# EAGLE design M149A (EAGLE 6.6.0)
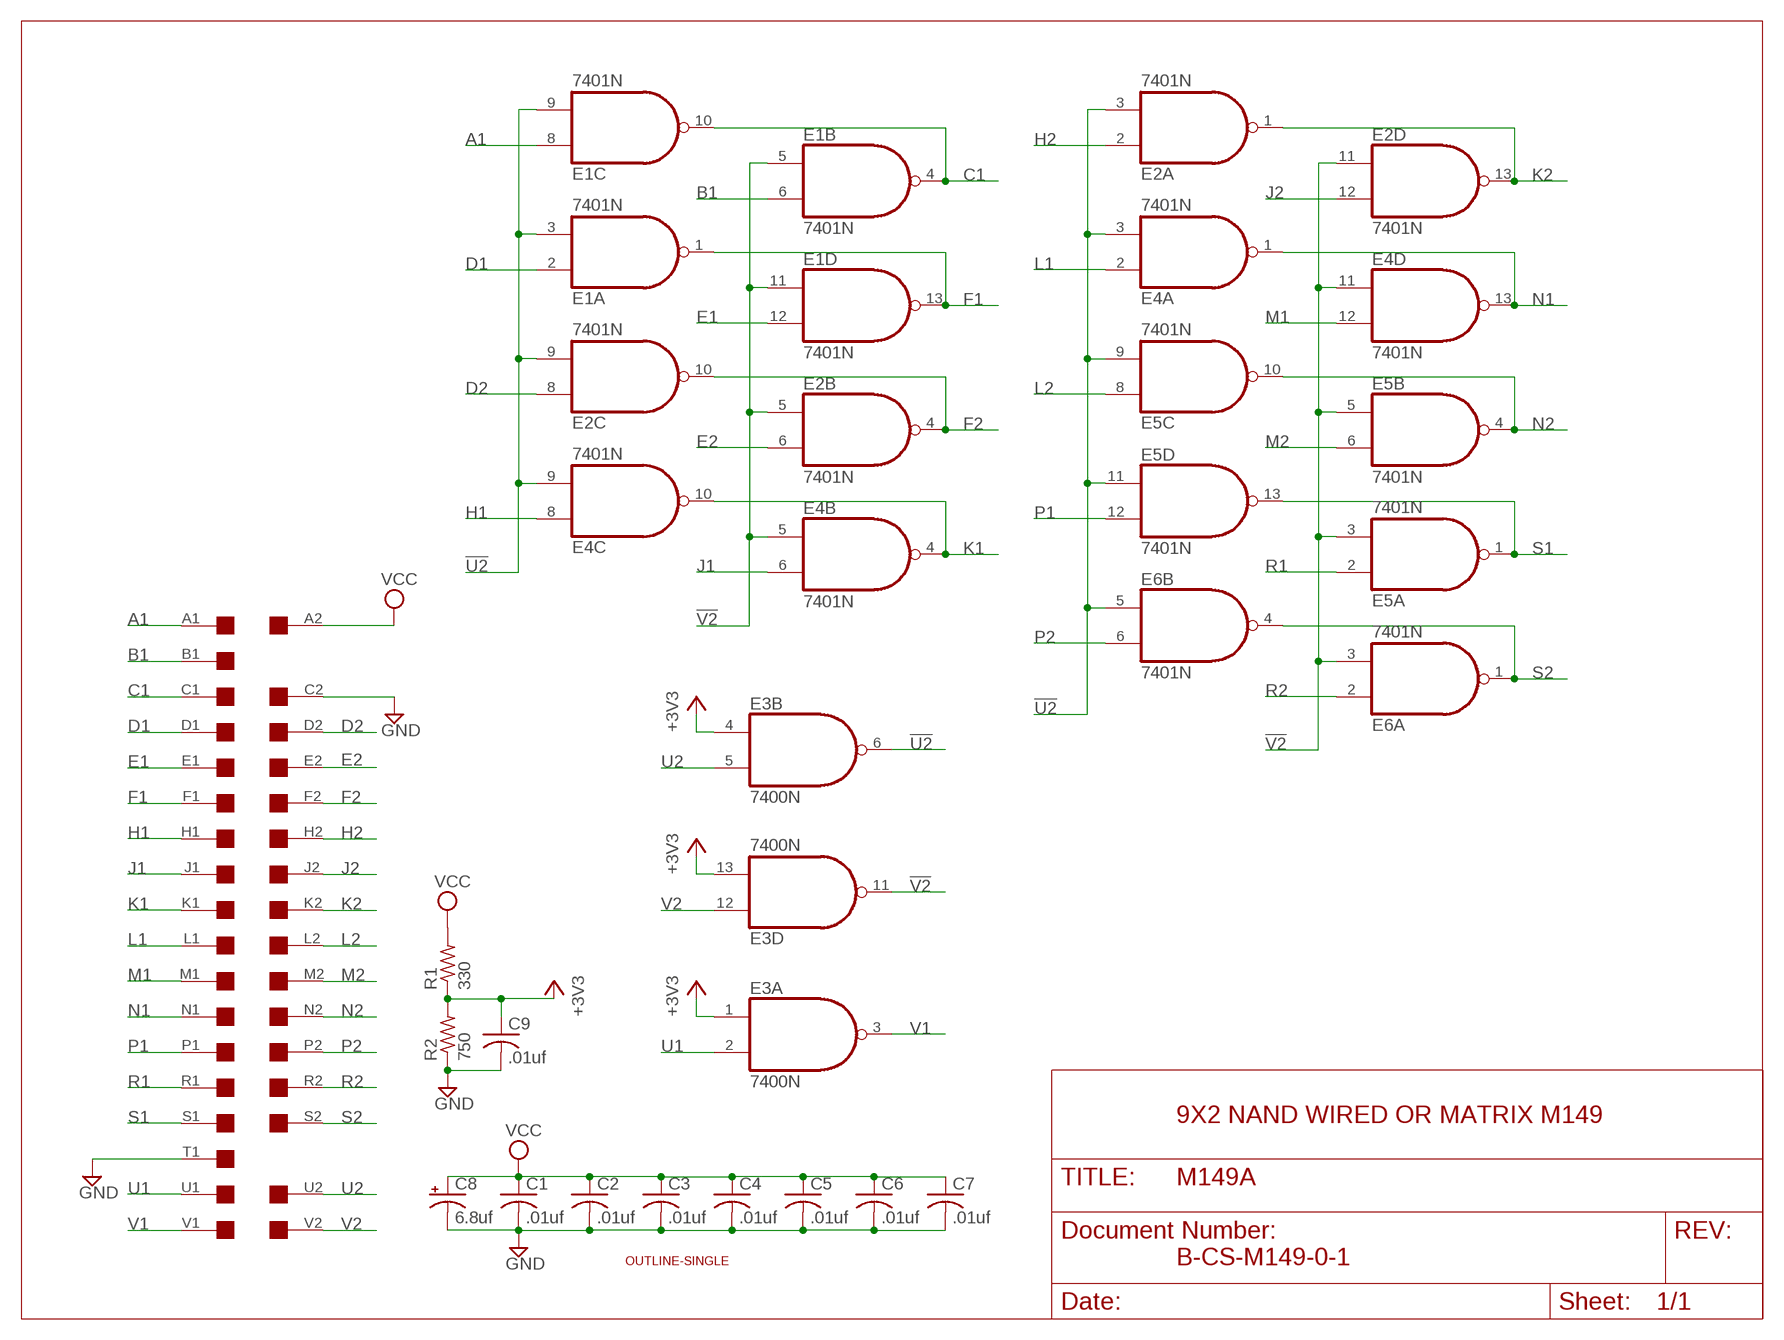
[diagram p0: schematic, sheet 1]

## Parts
C1  .01uf  C-US050-025X075  [C050-025X075]
C2  .01uf  C-US050-025X075  [C050-025X075]
C3  .01uf  C-US050-025X075  [C050-025X075]
C4  .01uf  C-US050-025X075  [C050-025X075]
C5  .01uf  C-US050-025X075  [C050-025X075]
C6  .01uf  C-US050-025X075  [C050-025X075]
C7  .01uf  C-US050-025X075  [C050-025X075]
C8  6.8uf  CPOL-USE15-5AXIAL  [E15-5]
C9  .01uf  C-US050-025X075  [C050-025X075]
E1  7401N  74LS01N  [DIL14]
E2  7401N  74LS01N  [DIL14]
E3  7400N  [DIL14]
E4  7401N  74LS01N  [DIL14]
E5  7401N  74LS01N  [DIL14]
E6  7401N  74LS01N  [DIL14]
R1  330  R-US_0207/10  [0207/10]
R2  750  R-US_0207/10  [0207/10]
U$1  SINGLE  [EDGE-CON2]
U$4  OUTLINE-SINGLE  [SINGLE]

## Nets
!U2: E1.3(A:I1) E1.9(C:I1) E2.3(A:I1) E2.9(C:I1) E3.6(B:O) E4.3(A:I1) E4.9(C:I1) E5.9(C:I1) E5.11(D:I0) E6.5(B:I0)
!V2: E1.5(B:I0) E1.11(D:I0) E2.5(B:I0) E2.11(D:I0) E3.11(D:O) E4.5(B:I0) E4.11(D:I0) E5.3(A:I1) E5.5(B:I0) E6.3(A:I1)
+3V3: C9.1 E3.1(A:I0) E3.4(B:I0) E3.13(D:I1) R1.1 R2.2
A1: E1.8(C:I0) U$1.A1
B1: E1.6(B:I1) U$1.B1
C1: E1.4(B:O) E1.10(C:O) U$1.C1
D1: E1.2(A:I0) U$1.D1
D2: E2.8(C:I0) U$1.D2
E1: E1.12(D:I1) U$1.E1
E2: E2.6(B:I1) U$1.E2
F1: E1.1(A:O) E1.13(D:O) U$1.F1
F2: E2.4(B:O) E2.10(C:O) U$1.F2
GND [Supply]: C1.2 C2.2 C3.2 C4.2 C5.2 C6.2 C7.2 C8.- C9.2 R2.1 U$1.C2 U$1.T1
H1: E4.8(C:I0) U$1.H1
H2: E2.2(A:I0) U$1.H2
J1: E4.6(B:I1) U$1.J1
J2: E2.12(D:I1) U$1.J2
K1: E4.4(B:O) E4.10(C:O) U$1.K1
K2: E2.1(A:O) E2.13(D:O) U$1.K2
L1: E4.2(A:I0) U$1.L1
L2: E5.8(C:I0) U$1.L2
M1: E4.12(D:I1) U$1.M1
M2: E5.6(B:I1) U$1.M2
N1: E4.1(A:O) E4.13(D:O) U$1.N1
N2: E5.4(B:O) E5.10(C:O) U$1.N2
P1: E5.12(D:I1) U$1.P1
P2: E6.6(B:I1) U$1.P2
R1: E5.2(A:I0) U$1.R1
R2: E6.2(A:I0) U$1.R2
S1: E5.1(A:O) E5.13(D:O) U$1.S1
S2: E6.1(A:O) E6.4(B:O) U$1.S2
U1: E3.2(A:I1) U$1.U1
U2: E3.5(B:I1) U$1.U2
V1: E3.3(A:O) U$1.V1
V2: E3.12(D:I0) U$1.V2
VCC [Supply]: C1.1 C2.1 C3.1 C4.1 C5.1 C6.1 C7.1 C8.+ R1.2 U$1.A2
Unconnected: E3.8(C:O) E3.9(C:I0) E3.10(C:I1) E6.8(C:I0) E6.9(C:I1) E6.10(C:O) E6.11(D:I0) E6.12(D:I1) E6.13(D:O) U$1.B2 U$1.T2

## Notes on the sheet
- 9X2 NAND WIRED OR MATRIX M149
- B-CS-M149-0-1

## Power pins joined to a net without a drawn wire
GND: E1.7(P:GND) E2.7(P:GND) E3.7(P:GND) E4.7(P:GND) E5.7(P:GND) E6.7(P:GND)
VCC: E1.14(P:VCC) E2.14(P:VCC) E3.14(P:VCC) E4.14(P:VCC) E5.14(P:VCC) E6.14(P:VCC)

## Library data of the parts
C1-C7 C9 = rcl:C-US: CAPACITOR, American symbol
C8 = rcl:CPOL-US: POLARIZED CAPACITOR, American symbol
E1 E2 E4-E6 = 74xx-us:74*01: Quad 2-input NAND gate, open collector
E3 = 74xx-us:74*00: Quad 2-input NAND gate
R1 R2 = rcl:R-US_: RESISTOR, American symbol
U$1 = dec-con:SINGLE: Single-Height DEC board
U$4 = dec-con:OUTLINE-*: Board outlines for DEC boards.

## Net classes
1 Supply: width 0.813 mm

## Board
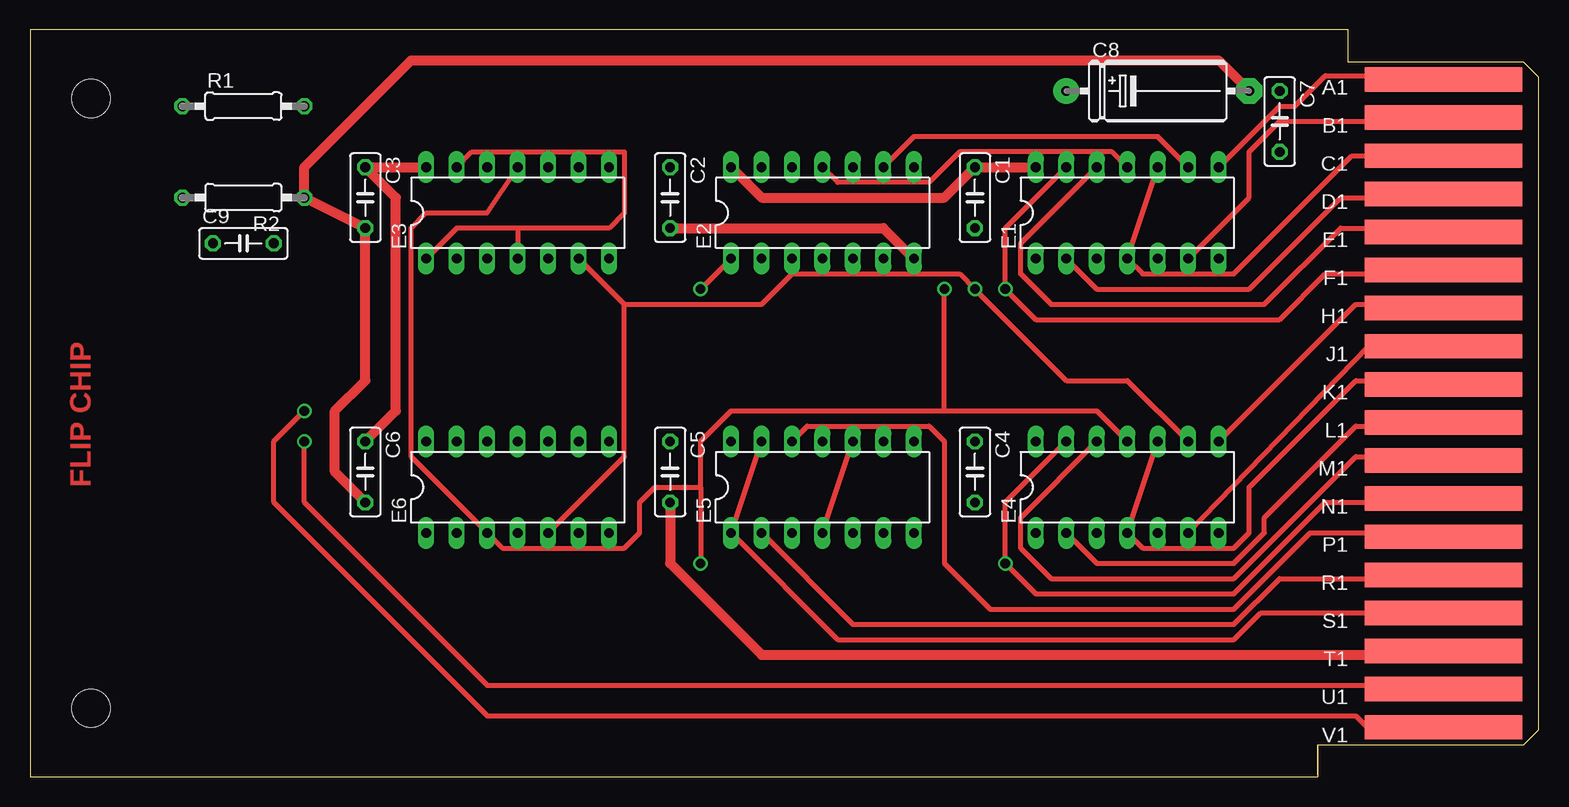
[diagram p1: board, top side]
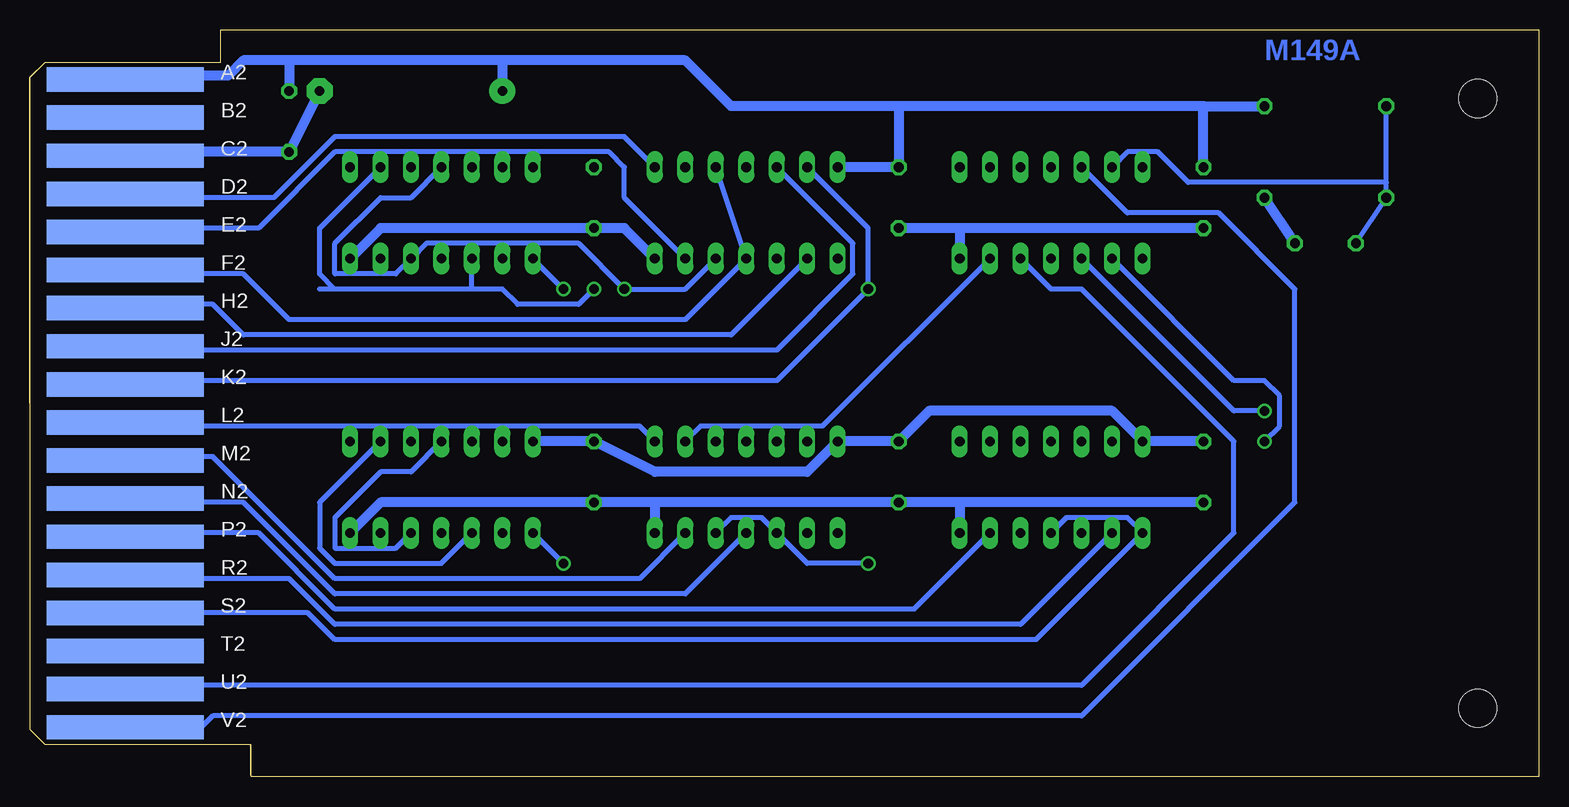
[diagram p2: board, bottom side, seen from below]

Size 125.73 x 62.23 mm. Coordinates in mm from the lower left corner, seen from the top.
Copper layers (1+16): Top 0.035mm / dielectric 1.5mm / Bottom 0.035mm
Design rules "16mils": minimum track width 16mil, minimum drill 32mil, track to track 15mil, track to pad 10mil, pad to pad 10mil, via to via 10mil, smd to smd 10mil, copper to edge 13mil, drill to drill 10mil, minimum pad ring 10mil, minimum via ring 8mil, stop-mask expansion 0mil, vias tented up to drill 0mil, thermal gap 10mil

### Footprints (pad centres in the part's own frame; a part is rotated, then mirrored left to right if it is on the bottom)
C050-025X075 = drill 0.813 octagon: 1 -2.54,0; 2 2.54,0
E15-5 = drill 0.813 pad 2.159: + -7.62,0 | drill 0.813 pad 2.159 octagon: - 7.62,0
DIL14 = drill 0.813 long: 1 -7.62,-3.81; 2 -5.08,-3.81; 3 -2.54,-3.81; 4 0,-3.81; 5 2.54,-3.81; 6 5.08,-3.81; 7 7.62,-3.81; 8 7.62,3.81; 9 5.08,3.81; 10 2.54,3.81; 11 0,3.81; 12 -2.54,3.81; 13 -5.08,3.81; 14 -7.62,3.81
0207/10 = drill 0.813 octagon: 1 -5.08,0; 2 5.08,0
EDGE-CON2 = smd 13.106 x 2.032: A1 7.938,4.128; B1 7.938,7.303; C1 7.938,10.477; D1 7.938,13.652; E1 7.938,16.828; F1 7.938,20.003; H1 7.938,23.177; J1 7.938,26.352; K1 7.938,29.527; L1 7.938,32.703; M1 7.938,35.877; N1 7.938,39.053; P1 7.938,42.227; R1 7.938,45.403; S1 7.938,48.578; T1 7.938,51.752; U1 7.938,54.928; V1 7.938,58.102 | smd 13.106 x 2.032 bottom: A2 7.938,4.128; B2 7.938,7.303; C2 7.938,10.477; D2 7.938,13.652; E2 7.938,16.828; F2 7.938,20.003; H2 7.938,23.177; J2 7.938,26.352; K2 7.938,29.527; L2 7.938,32.703; M2 7.938,35.877; N2 7.938,39.053; P2 7.938,42.227; R2 7.938,45.403; S2 7.938,48.578; T2 7.938,51.752; U2 7.938,54.928; V2 7.938,58.102
SINGLE = hole 3.175: 120.65,56.515; 120.65,5.715

### Placement (x,y rotation side)
C1  78.74,48.26 270 top
C2  53.34,48.26 270 top
C3  27.94,48.26 270 top
C4  78.74,25.4 270 top
C5  53.34,25.4 270 top
C6  27.94,25.4 270 top
C7  104.14,54.61 270 top
C8  93.98,57.15 0 top
C9  17.78,44.45 0 top
E1  91.44,46.99 0 top
E2  66.04,46.99 0 top
E3  40.64,46.99 0 top
E4  91.44,24.13 0 top
E5  66.04,24.13 0 top
E6  40.64,24.13 0 top
R1  17.78,55.88 0 top
R2  17.78,48.26 180 top
U$1  125.73,62.23 180 top
U$4  125.73,62.23 180 top

### Tracks (layer width: path | path; a pad name or v marks a point on that pad's centre or on a via)
!U2  (via drill 0.81)
  Top 0.406: E1.9 93.98,53.34 73.66,53.34 E2.9 | 49.53,39.37 E3.6 | 49.53,39.37 49.53,26.67 E6.5 | 63.5,41.91 77.47,41.91 v78.74,40.64 86.36,33.02 91.44,33.02 E4.9 | 49.53,39.37 60.96,39.37 63.5,41.91 | 63.5,41.91 E2.3
  Bottom 0.406: E4.3 91.44,17.78 100.33,17.78 101.6,19.05 101.6,22.86 E4.9 | v78.74,40.64 80.01,39.37 85.09,39.37 86.36,40.64 88.9,40.64 | 88.9,40.64 100.33,40.64 | 100.33,40.64 101.6,40.64 | 88.9,40.64 E1.3 | E1.9 101.6,45.72 101.6,41.91 100.33,40.64 | E5.9 69.85,29.21 66.04,29.21 | 66.04,29.21 E5.11 | 66.04,29.21 59.69,29.21 E3.6
!V2  (via drill 0.81)
  Top 0.406: 55.88,24.13 52.07,24.13 50.8,22.86 50.8,20.32 49.53,19.05 39.37,19.05 E6.3 31.75,26.67 31.75,45.72 33.02,46.99 38.1,46.99 E3.11 | 55.88,24.13 v55.88,17.78 | 55.88,24.13 55.88,27.94 58.42,30.48 76.2,30.48 | 76.2,30.48 v76.2,40.64 | 76.2,30.48 88.9,30.48 E4.11 | E2.11 67.31,49.53 74.93,49.53 77.47,52.07 90.17,52.07 E1.11
  Bottom 0.406: E2.5 71.12,40.64 v76.2,40.64 80.01,44.45 92.71,44.45 E1.5 95.25,41.91 100.33,41.91 100.33,44.45 96.52,48.26 93.98,48.26 E1.11 | E5.5 67.31,21.59 64.77,21.59 E5.3 60.96,17.78 v55.88,17.78 | E4.5 95.25,19.05 100.33,19.05 100.33,21.59 96.52,25.4 93.98,25.4 E4.11
+3V3
  Top 0.406: E3.13 36.83,52.07 49.53,52.07 49.53,46.99 48.26,45.72 40.64,45.72 | E3.1 35.56,45.72 40.64,45.72 | 40.64,45.72 E3.4
  Bottom 0.406: 12.7,49.53 R2.2 C9.1 | 12.7,49.53 R1.1 | 12.7,49.53 29.21,49.53 31.75,52.07 34.29,52.07 E3.13
A1
  Top 0.406: U$1.A1 112.16,58.02 111.76,58.42 107.95,58.42 105.41,55.88 104.14,55.88 E1.8
B1
  Top 0.406: U$1.B1 112.05,54.9 111.76,54.61 104.14,54.61 101.6,52.07 101.6,48.26 E1.6
C1
  Top 0.406: U$1.C1 110.16,51.74 100.33,41.91 92.71,41.91 E1.4 E1.10
D1
  Top 0.406: U$1.D1 111.76,48.26 109.22,48.26 101.6,40.64 88.9,40.64 E1.2
D2
  Bottom 0.406: U$1.D2 117.78,48.26 105.41,48.26 100.33,53.34 76.2,53.34 E2.8
E1
  Top 0.406: U$1.E1 112.09,45.39 111.76,45.72 109.22,45.72 102.87,39.37 85.09,39.37 82.55,41.91 82.55,44.45 E1.12
E2
  Bottom 0.406: E2.6 76.2,48.26 76.2,50.8 77.47,52.07 100.33,52.07 106.68,45.72 111.76,45.72 U$1.E2
F1  (via drill 0.81)
  Top 0.406: U$1.F1 112.04,42.19 111.76,41.91 107.95,41.91 104.14,38.1 83.82,38.1 v81.28,40.64 81.28,45.72 E1.13
  Bottom 0.406: v81.28,40.64 E1.1
F2
  Bottom 0.406: E2.10 E2.4 71.12,38.1 104.14,38.1 107.95,41.91 111.76,41.91 112.04,42.19 U$1.F2
GND
  Top 0.813: C8.- 99.06,59.69 31.75,59.69 22.86,50.8 R2.1 C3.2 27.94,33.02 25.4,30.48 25.4,25.4 C6.2 | U$1.T1 112.09,10.49 111.76,10.16 60.96,10.16 53.34,17.78 C5.2 | C2.2 71.12,45.72 E2.7
  Bottom 0.813: U$1.C2 112.09,51.74 111.76,52.07 C7.2 C8.- | R2.1 C9.2 | 48.26,45.72 E3.7 | C3.2 48.26,45.72 | E1.7 96.52,45.72 C1.2 76.2,45.72 E2.7 | 48.26,45.72 C2.2 | E4.7 96.52,22.86 C4.2 73.66,22.86 | 73.66,22.86 C5.2 48.26,22.86 | 73.66,22.86 E5.7 | C6.2 48.26,22.86 | 48.26,22.86 E6.7
H1
  Top 0.406: U$1.H1 112.09,39.04 111.76,39.37 110.49,39.37 E4.8
H2
  Bottom 0.406: U$1.H2 112.09,39.04 111.76,39.37 110.49,39.37 107.95,36.83 67.31,36.83 E2.2
J1
  Top 0.406: U$1.J1 111.58,35.89 E4.6
J2
  Bottom 0.406: E2.12 57.15,44.45 57.15,41.91 63.5,35.56 111.76,35.56 112.09,35.89 U$1.J2
K1
  Top 0.406: U$1.K1 112.06,32.72 111.76,33.02 110.49,33.02 101.6,24.13 101.6,20.32 100.33,19.05 92.71,19.05 E4.4 E4.10
K2  (via drill 0.81)
  Top 0.406: v55.88,40.64 E2.1
  Bottom 0.406: E2.13 55.88,45.72 v55.88,40.64 63.5,33.02 111.76,33.02 112.06,32.72 U$1.K2
L1
  Top 0.406: E4.2 88.9,17.78 100.33,17.78 102.87,20.32 102.87,21.59 110.49,29.21 111.76,29.21 112.09,29.54 U$1.L1
L2
  Bottom 0.406: U$1.L2 112.09,29.54 111.76,29.21 74.93,29.21 E5.8
M1
  Top 0.406: U$1.M1 112.09,26.34 111.76,26.67 110.49,26.67 100.33,16.51 85.09,16.51 82.55,19.05 82.55,21.59 E4.12
M2
  Bottom 0.406: U$1.M2 112.09,26.34 111.76,26.67 110.49,26.67 100.33,16.51 74.93,16.51 E5.6
N1  (via drill 0.81)
  Top 0.406: U$1.N1 112.09,23.19 111.76,22.86 107.95,22.86 100.33,15.24 83.82,15.24 v81.28,17.78 81.28,22.86 E4.13
  Bottom 0.406: v81.28,17.78 E4.1
N2
  Top 0.406: E5.4 E5.10
  Bottom 0.406: U$1.N2 112.09,23.19 111.76,22.86 107.95,22.86 100.33,15.24 71.12,15.24 E5.4
P1
  Top 0.406: U$1.P1 112.09,19.99 111.76,20.32 106.68,20.32 100.33,13.97 80.01,13.97 76.2,17.78 76.2,27.94 74.93,29.21 64.77,29.21 E5.12
P2
  Bottom 0.406: U$1.P2 112.09,19.99 111.76,20.32 106.68,20.32 100.33,13.97 52.07,13.97 E6.6
R1
  Top 0.406: U$1.R1 112.09,16.84 111.76,16.51 104.14,16.51 100.33,12.7 68.58,12.7 E5.2
R2
  Bottom 0.406: U$1.R2 112.09,16.84 111.76,16.51 104.14,16.51 100.33,12.7 43.18,12.7 E6.2
S1
  Top 0.406: U$1.S1 102.56,13.66 100.33,11.43 67.31,11.43 E5.1 E5.13
S2
  Bottom 0.406: U$1.S2 102.56,13.66 100.33,11.43 41.91,11.43 E6.1 34.29,21.59 39.37,21.59 E6.4
U1  (via drill 0.81)
  Top 0.406: U$1.U1 112.12,7.26 111.76,7.62 38.1,7.62 22.86,22.86 v22.86,27.94
  Bottom 0.406: v22.86,27.94 21.59,29.21 21.59,31.75 22.86,33.02 25.4,33.02 E3.2
U2
  Bottom 0.406: U$1.U2 112.12,7.26 111.76,7.62 38.1,7.62 25.4,20.32 25.4,27.94 38.1,40.64 40.64,40.64 E3.5
V1  (via drill 0.81)
  Top 0.406: U$1.V1 111.37,4.2 110.49,5.08 38.1,5.08 20.32,22.86 20.32,27.94 v22.86,30.48
  Bottom 0.406: v22.86,30.48 25.4,30.48 E3.3
V2
  Bottom 0.406: U$1.V2 111.37,4.2 110.49,5.08 38.1,5.08 20.32,22.86 20.32,40.64 26.67,46.99 34.29,46.99 E3.12
VCC
  Top 0.813: E3.14 C3.1 30.48,48.26 30.48,30.48 C6.1 | E1.14 C1.1 76.2,48.26 60.96,48.26 E2.14
  Bottom 0.813: U$1.A2 112.16,58.02 111.76,58.42 109.22,58.42 107.95,59.69 104.14,59.69 | 104.14,59.69 C7.1 | 86.36,59.69 C8.+ | 86.36,59.69 104.14,59.69 | 27.94,55.88 R1.2 | 27.94,55.88 53.34,55.88 | 53.34,55.88 67.31,55.88 71.12,59.69 86.36,59.69 | C3.1 27.94,55.88 | 53.34,55.88 C2.1 E2.14 | C6.1 E6.14 35.56,30.48 50.8,30.48 C5.1 E5.14 60.96,25.4 73.66,25.4 C4.1 E4.14

### Text on the board
Top: FLIP CHIP
Bottom: M149A